# EAGLE design pwmBoard (EAGLE 8.4.3)
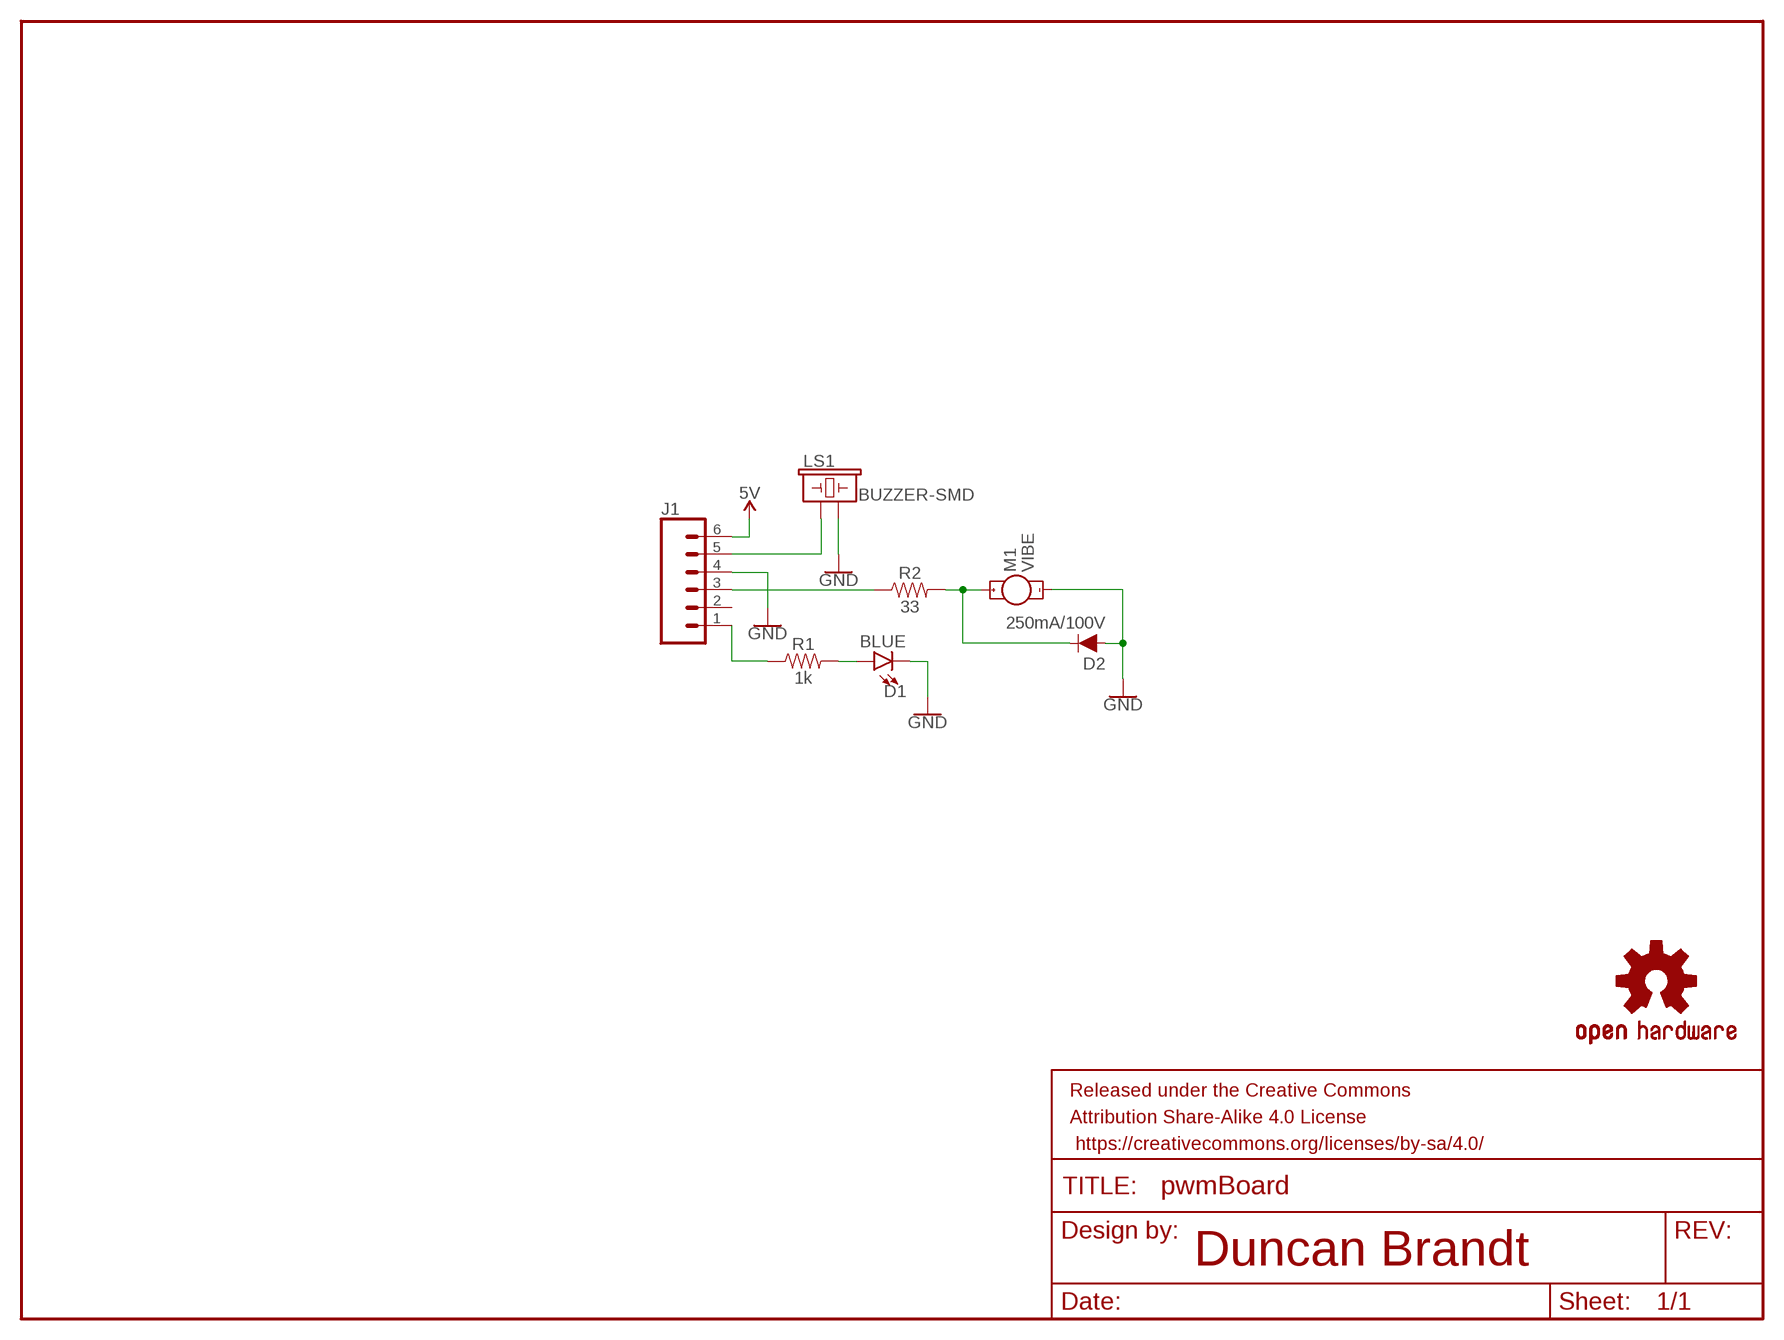
[diagram p0: schematic, sheet 1]

## Parts
D1  BLUE  LED-BLUE1206  [LED-1206]
D2  250mA/100V  DIODE-BAS16J  [SOD-323]
FRAME1  FRAME-LETTER  [CREATIVE_COMMONS]
J1  CONN_06SILK_FEMALE_PTH  [1X06]
LOGO1  OSHW-LOGOL  [OSHW-LOGO-L]
LS1  BUZZER-SMD  [BUZZER-CCV]
M1  VIBE  MOTOR10MM  [VIBE-MOTOR-10MM]
R1  1k  1KOHM-0603-1/10W-1%  [0603]
R2  33  33OHM-0603-1/10W-1%  [0603]

## Nets
5V: J1.6
GND: D1.C D2.A J1.4 LS1.- M1.-
N$1: J1.1 R1.1
N$2: D1.A R1.2
N$3: D2.C M1.+ R2.2
N$4: J1.3 R2.1
N$5: J1.5 LS1.+
Unconnected: J1.2

## Notes on the sheet
- Duncan Brandt

## Library data of the parts
D1 = DB-LED:LED-BLUE: Blue SMD LED
D2 = DB-DESCSEMI:DIODE: Diode These are standard reverse protection diodes.
FRAME1 = DB-SYMBOLS:FRAME-LETTER: Schematic Frame - Letter Standard 8.5x11 US Letter frame
J1 = DB-CONN:CONN_06: Multi connection point. Often used as Generic Header-pin footprint for 0.1 inch spaced/style header connections On any of the 0.1 inch spaced packages, you can populate with these: Break Away Headers - Straight <https://www.sparkfun.com/products/116> (PRT-00116) Break Away Male Headers - Right Angle <https://www.sparkfun.com/products/553> (PRT-00553) Female Headers <https://www.sparkfun.com/products/115> (PRT-00115) Break Away Headers - Machine Pin <https://www.sparkfun.com/products/117> (PRT-00117) Break Away Female Headers - Swiss Machine Pin <https://www.sparkfun.com/products/743> (PRT-00743) Arduino Stackable Header - 6 Pin <https://www.sparkfun.com/products/9280> (PRT-09280) For SCREWTERMINALS and SPRING TERMINALS visit here: Screw Terimnals on SparkFun.com <https://www.sparkfun.com/search/results?term=Screw+Terminals> (5mm/3.5mm/2.54mm spacing) This device is also useful as a general connection point to wire up your design to another part of your project. Our various solder wires solder well into these plated through hole pads. Hook-Up Wire - Assortment (Stranded, 22 AWG) <https://www.sparkfun.com/products/11375> (PRT-11375) Hook-Up Wire - Assortment (Solid Core, 22 AWG) <https://www.sparkfun.com/products/11367> (PRT-11367) View the entire wire category on our website here <https://www.sparkfun.com/categories/141>; PROD_ID: CONN-08437
LOGO1 = DB-SYMBOLS:OSHW-LOGO: Open-Source Hardware (OSHW) Logo This logo indicates the piece of hardware it is found on incorporates a OSHW license and/or adheres to the definition of open source hardware found here: http://freedomdefined.org/OSHW
LS1 = DB-EMECH:BUZZER: Buzzer SMD buzzers that operate around the 2kHz range. These work great as small alarms for all purposes.
M1 = DB-EMECH:MOTOR: Motor (Single-Phase) Two-terminal, single-phase motors. They are slightly stronger then a phone vibration.; PROD_ID: COMP-08572; SF_SKU: ROB-08449
R1 = DB-RES:1KOHM: 1kΩ Resistor Package: 0603 A resistor is a passive two-terminal electrical component that implements electrical resistance as a circuit element. Resistors act to reduce current flow, and, at the same time, act to lower voltage levels within circuits. - Wikipedia DB BOARDS: DB Drawing Board <www.dbboards.com>; PROD_ID: RES-07856
R2 = DB-RES:33OHM: 33Ω resistor A resistor is a passive two-terminal electrical component that implements electrical resistance as a circuit element. Resistors act to reduce current flow, and, at the same time, act to lower voltage levels within circuits. - Wikipedia

## Board
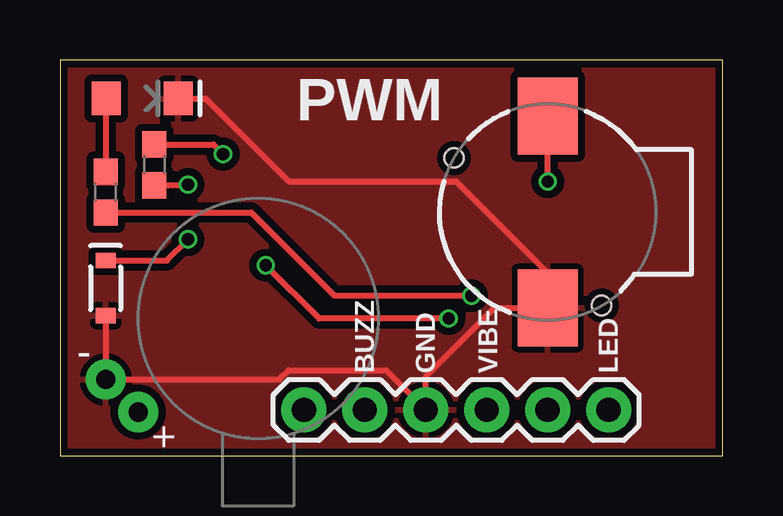
[diagram p1: board, top side]
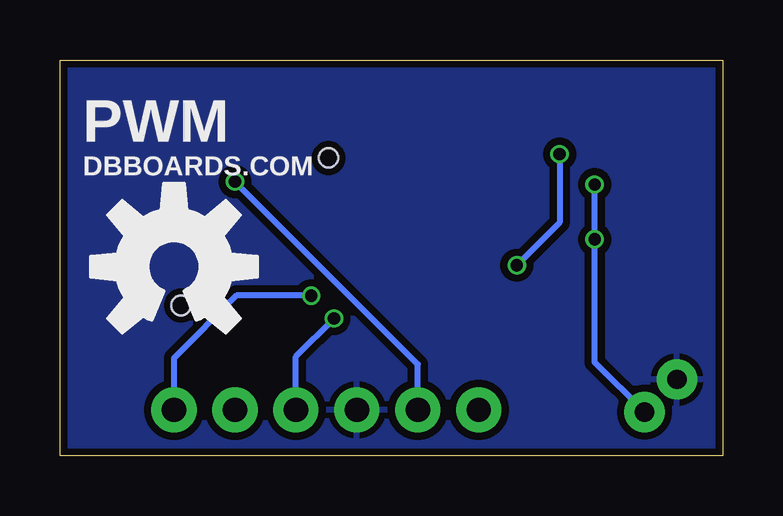
[diagram p2: board, bottom side, seen from below]

Size 27.61 x 16.5 mm. Coordinates in mm from the lower left corner, seen from the top.
Outline: 0,0 27.61,0 27.61,16.5 0,16.5 0,0
Copper layers (1*16): Top 0.035mm / dielectric 1.5mm / Bottom 0.035mm
Design rules "SparkFun-2-layer-FAB-LIMIT": minimum track width 4mil, minimum drill 6mil, track to track 4mil, track to pad 4mil, pad to pad 4mil, via to via 4mil, smd to smd 4mil, copper to edge 4mil, drill to drill 4mil, minimum pad ring 5mil, minimum via ring 5mil, stop-mask expansion 4mil, vias tented up to drill 25mil, thermal gap 10mil

### Footprints (pad centres in the part's own frame; a part is rotated, then mirrored left to right if it is on the bottom)
LED-1206 = smd 1.2 x 1.4: A -1.5,0; C 1.5,0
SOD-323 = smd 0.63 x 0.83: A 1.15,0; C -1.15,0
1X06 = drill 1.016 pad 1.88: 1 0,0; 2 2.54,0; 3 5.08,0; 4 7.62,0; 5 10.16,0; 6 12.7,0
BUZZER-CCV = smd 3.2 x 2.5: + 4,0; - -4,0 | hole 0.8: -3.9,-2.25; 2.25,3.9
VIBE-MOTOR-10MM = drill 0.8 pad 1.676: + -5,-3.9; - -6.35,-2.54
0603 = smd 1.1 x 1: 1 -0.85,0; 2 0.85,0

### Placement (x,y rotation side)
D1  3.43,14.89 0 top
D2  1.91,6.99 270 top
FRAME1  -101.6,13.97 0 top  (outside the outline)
J1  22.86,1.91 180 top
LOGO1  22.86,7.87 0 bottom
LS1  20.32,10.16 90 top
M1  8.26,5.71 0 top
R1  1.91,10.99 90 top
R2  3.94,12.13 270 top

### Tracks (layer width: path | path; a pad name or v marks a point on that pad's centre or on a via)
GND
  Top 0.254: D1.C 6.07,14.89 9.53,11.43 16.51,11.43 20.32,7.62 LS1.- 18.1,6.16 15.24,3.3 J1.4 13.59,3.56 9.53,3.56 9.14,3.17 M1.- D2.A
  pour Bottom (isolate 0.305): 0,0 0,16.51 27.62,16.51 27.62,0
  pour Top (isolate 0.305): 27.62,0 27.62,16.51 0,16.51 0,0
N$1  (via drill 0.51)
  Top 0.254: v17.14,6.67 11.43,6.67 7.96,10.14 R1.1
  Bottom 0.254: v17.14,6.67 20.26,6.67 22.86,4.06 J1.1
N$2
  Top 0.254: D1.A 1.91,14.87 R1.2
N$3  (via drill 0.51)
  Top 0.254: D2.C 4.45,8.13 v5.33,9.02 | R2.2 5.31,11.28 v5.33,11.3
  Bottom 0.254: v5.33,11.3 v5.33,9.02 5.33,3.89 M1.+
N$4  (via drill 0.51)
  Top 0.254: v16.19,5.71 10.79,5.71 v8.57,7.94 | R2.1 6.39,12.98 v6.79,12.57
  Bottom 0.254: J1.3 17.78,4.13 v16.19,5.71 | v6.79,12.57 6.79,9.72 v8.57,7.94
N$5  (via drill 0.51)
  Top 0.254: v20.32,11.43 LS1.+
  Bottom 0.254: J1.5 12.7,3.81 v20.32,11.43

### Text on the board
tPlace: PWM | BUZZ | GND | VIBE | LED
bPlace: PWM | DBBOARDS.COM